# EAGLE design SparkFun_XMega100_Breakout (EAGLE 7.2.0)

## Sheet 1 of 2
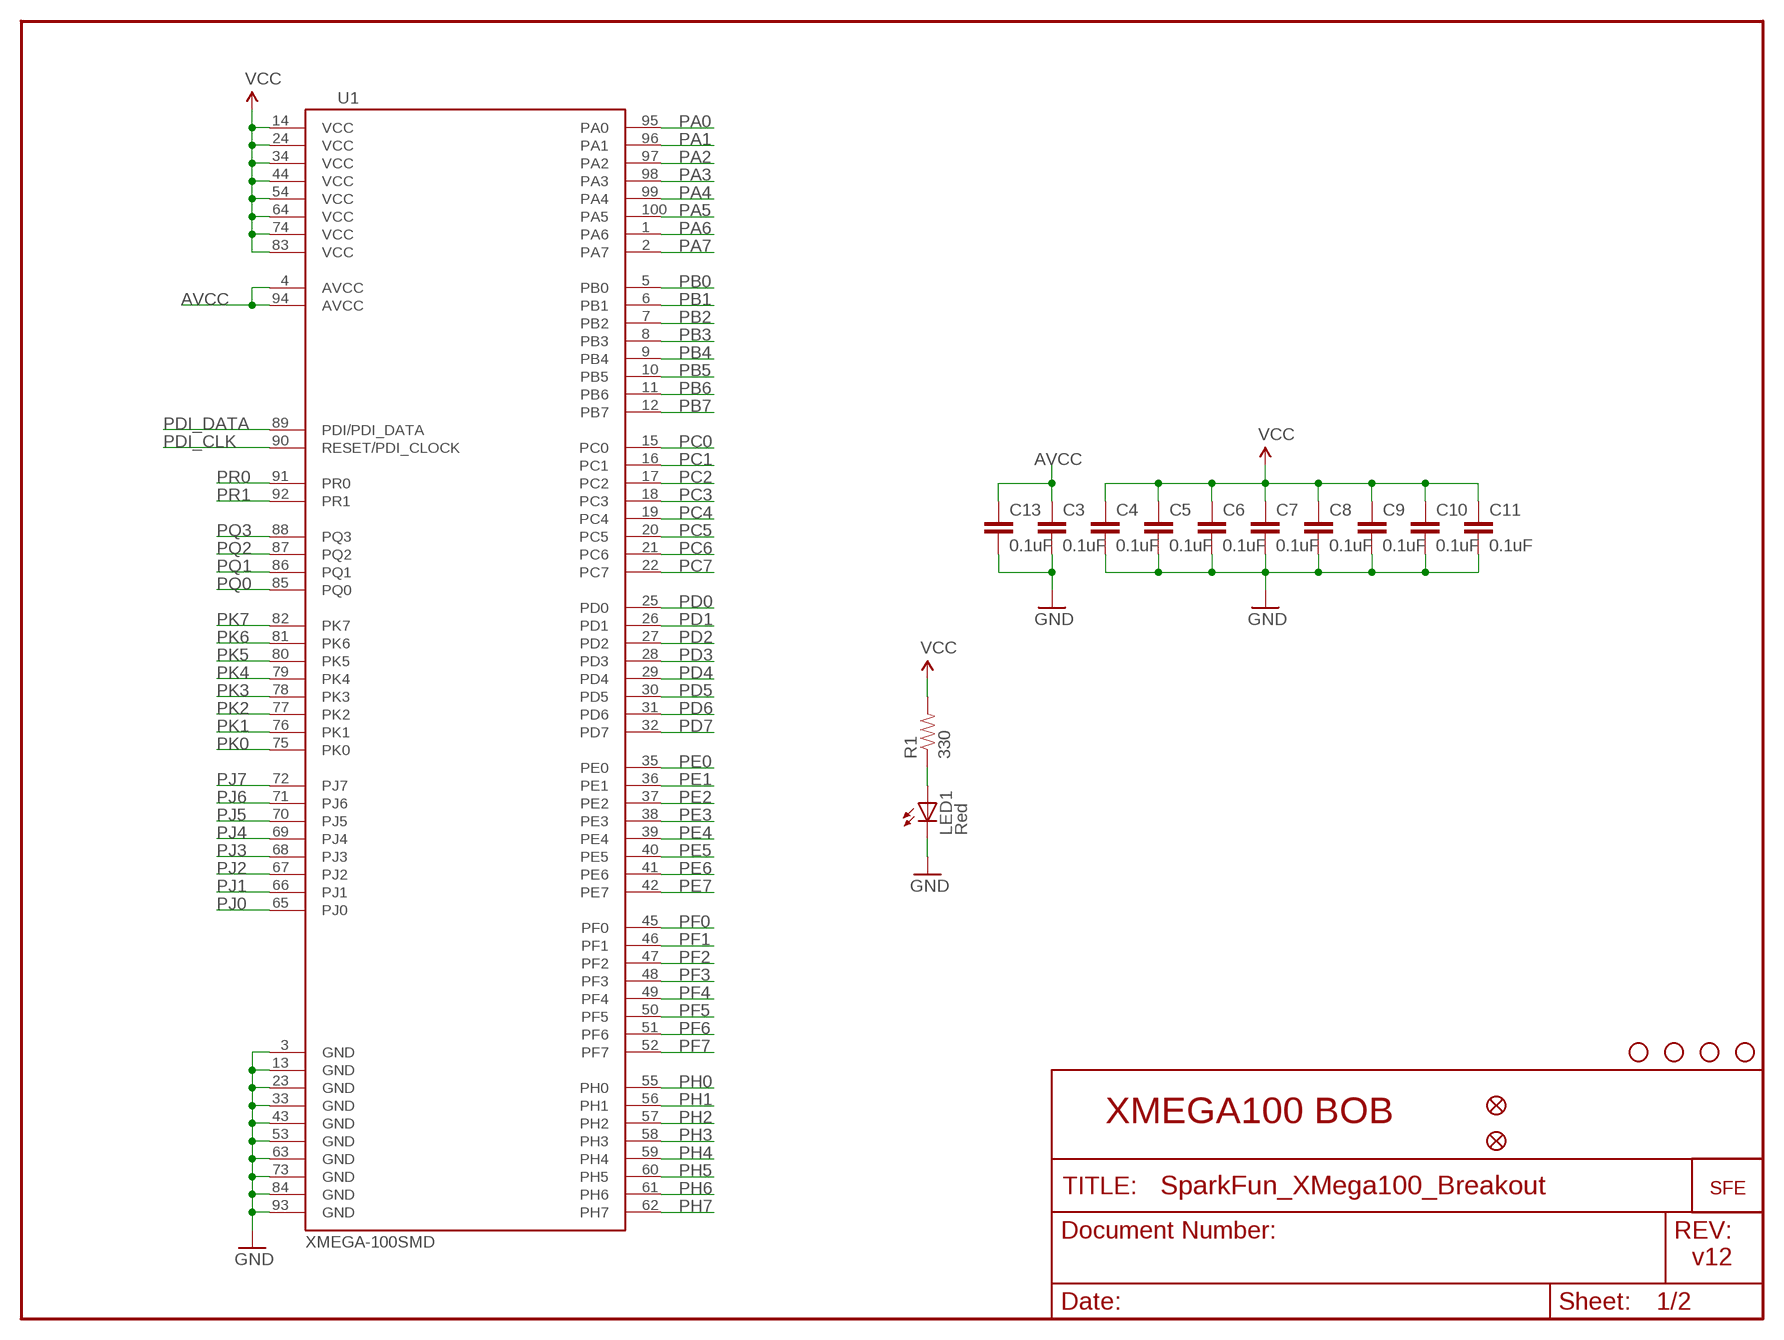
[diagram p0: schematic, sheet 1]

### Parts
C3  0.1uF  CAP0402-CAP  [0402-CAP]
C4  0.1uF  CAP0402-CAP  [0402-CAP]
C5  0.1uF  CAP0402-CAP  [0402-CAP]
C6  0.1uF  CAP0402-CAP  [0402-CAP]
C7  0.1uF  CAP0402-CAP  [0402-CAP]
C8  0.1uF  CAP0402-CAP  [0402-CAP]
C9  0.1uF  CAP0402-CAP  [0402-CAP]
C10  0.1uF  CAP0402-CAP  [0402-CAP]
C11  0.1uF  CAP0402-CAP  [0402-CAP]
C13  0.1uF  CAP0402-CAP  [0402-CAP]
JP1  LOGO-SFENEW  [SFE-NEW-WEBLOGO]
JP2  STAND-OFF  [STAND-OFF]
JP3  STAND-OFF  [STAND-OFF]
JP4  STAND-OFF  [STAND-OFF]
JP5  STAND-OFF  [STAND-OFF]
JP12  FIDUCIAL1X2  [FIDUCIAL-1X2]
JP13  FIDUCIAL1X2  [FIDUCIAL-1X2]
LED1  Red  LED0603  [LED-0603]
R1  330  RESISTOR0402-RES  [0402-RES]
U1  XMEGA-100SMD  [TQFP-100-14X14MM]

### Nets
AVCC: C3.1 C13.1 U1.4(AVCC) U1.94(AVCC) ; also sheet 2
GND: C3.2 C4.2 C5.2 C6.2 C7.2 C8.2 C9.2 C10.2 C11.2 C13.2 LED1.C U1.3(GND) U1.13(GND) U1.23(GND) U1.33(GND) U1.43(GND) U1.53(GND) U1.63(GND) U1.73(GND) U1.84(GND) U1.93(GND) ; also sheet 2
N$1: LED1.A R1.1
PA0: U1.95(PA0) ; also sheet 2
PA1: U1.96(PA1) ; also sheet 2
PA2: U1.97(PA2) ; also sheet 2
PA3: U1.98(PA3) ; also sheet 2
PA4: U1.99(PA4) ; also sheet 2
PA5: U1.100(PA5) ; also sheet 2
PA6: U1.1(PA6) ; also sheet 2
PA7: U1.2(PA7) ; also sheet 2
PB0: U1.5(PB0) ; also sheet 2
PB1: U1.6(PB1) ; also sheet 2
PB2: U1.7(PB2) ; also sheet 2
PB3: U1.8(PB3) ; also sheet 2
PB4: U1.9(PB4) ; also sheet 2
PB5: U1.10(PB5) ; also sheet 2
PB6: U1.11(PB6) ; also sheet 2
PB7: U1.12(PB7) ; also sheet 2
PC0: U1.15(PC0) ; also sheet 2
PC1: U1.16(PC1) ; also sheet 2
PC2: U1.17(PC2) ; also sheet 2
PC3: U1.18(PC3) ; also sheet 2
PC4: U1.19(PC4) ; also sheet 2
PC5: U1.20(PC5) ; also sheet 2
PC6: U1.21(PC6) ; also sheet 2
PC7: U1.22(PC7) ; also sheet 2
PD0: U1.25(PD0) ; also sheet 2
PD1: U1.26(PD1) ; also sheet 2
PD2: U1.27(PD2) ; also sheet 2
PD3: U1.28(PD3) ; also sheet 2
PD4: U1.29(PD4) ; also sheet 2
PD5: U1.30(PD5) ; also sheet 2
PD6: U1.31(PD6) ; also sheet 2
PD7: U1.32(PD7) ; also sheet 2
PDI_CLK: U1.90(RESET/PDI_CLOCK) ; also sheet 2
PDI_DATA: U1.89(PDI/PDI_DATA) ; also sheet 2
PE0: U1.35(PE0) ; also sheet 2
PE1: U1.36(PE1) ; also sheet 2
PE2: U1.37(PE2) ; also sheet 2
PE3: U1.38(PE3) ; also sheet 2
PE4: U1.39(PE4) ; also sheet 2
PE5: U1.40(PE5) ; also sheet 2
PE6: U1.41(PE6) ; also sheet 2
PE7: U1.42(PE7) ; also sheet 2
PF0: U1.45(PF0) ; also sheet 2
PF1: U1.46(PF1) ; also sheet 2
PF2: U1.47(PF2) ; also sheet 2
PF3: U1.48(PF3) ; also sheet 2
PF4: U1.49(PF4) ; also sheet 2
PF5: U1.50(PF5) ; also sheet 2
PF6: U1.51(PF6) ; also sheet 2
PF7: U1.52(PF7) ; also sheet 2
PH0: U1.55(PH0) ; also sheet 2
PH1: U1.56(PH1) ; also sheet 2
PH2: U1.57(PH2) ; also sheet 2
PH3: U1.58(PH3) ; also sheet 2
PH4: U1.59(PH4) ; also sheet 2
PH5: U1.60(PH5) ; also sheet 2
PH6: U1.61(PH6) ; also sheet 2
PH7: U1.62(PH7) ; also sheet 2
PJ0: U1.65(PJ0) ; also sheet 2
PJ1: U1.66(PJ1) ; also sheet 2
PJ2: U1.67(PJ2) ; also sheet 2
PJ3: U1.68(PJ3) ; also sheet 2
PJ4: U1.69(PJ4) ; also sheet 2
PJ5: U1.70(PJ5) ; also sheet 2
PJ6: U1.71(PJ6) ; also sheet 2
PJ7: U1.72(PJ7) ; also sheet 2
PK0: U1.75(PK0) ; also sheet 2
PK1: U1.76(PK1) ; also sheet 2
PK2: U1.77(PK2) ; also sheet 2
PK3: U1.78(PK3) ; also sheet 2
PK4: U1.79(PK4) ; also sheet 2
PK5: U1.80(PK5) ; also sheet 2
PK6: U1.81(PK6) ; also sheet 2
PK7: U1.82(PK7) ; also sheet 2
PQ0: U1.85(PQ0) ; also sheet 2
PQ1: U1.86(PQ1) ; also sheet 2
PQ2: U1.87(PQ2) ; also sheet 2
PQ3: U1.88(PQ3) ; also sheet 2
PR0: U1.91(PR0) ; also sheet 2
PR1: U1.92(PR1) ; also sheet 2
VCC: C4.1 C5.1 C6.1 C7.1 C8.1 C9.1 C10.1 C11.1 R1.2 U1.14(VCC) U1.24(VCC) U1.34(VCC) U1.44(VCC) U1.54(VCC) U1.64(VCC) U1.74(VCC) U1.83(VCC) ; also sheet 2

### Notes on the sheet
- XMEGA100 BOB
- v12

## Sheet 2 of 2
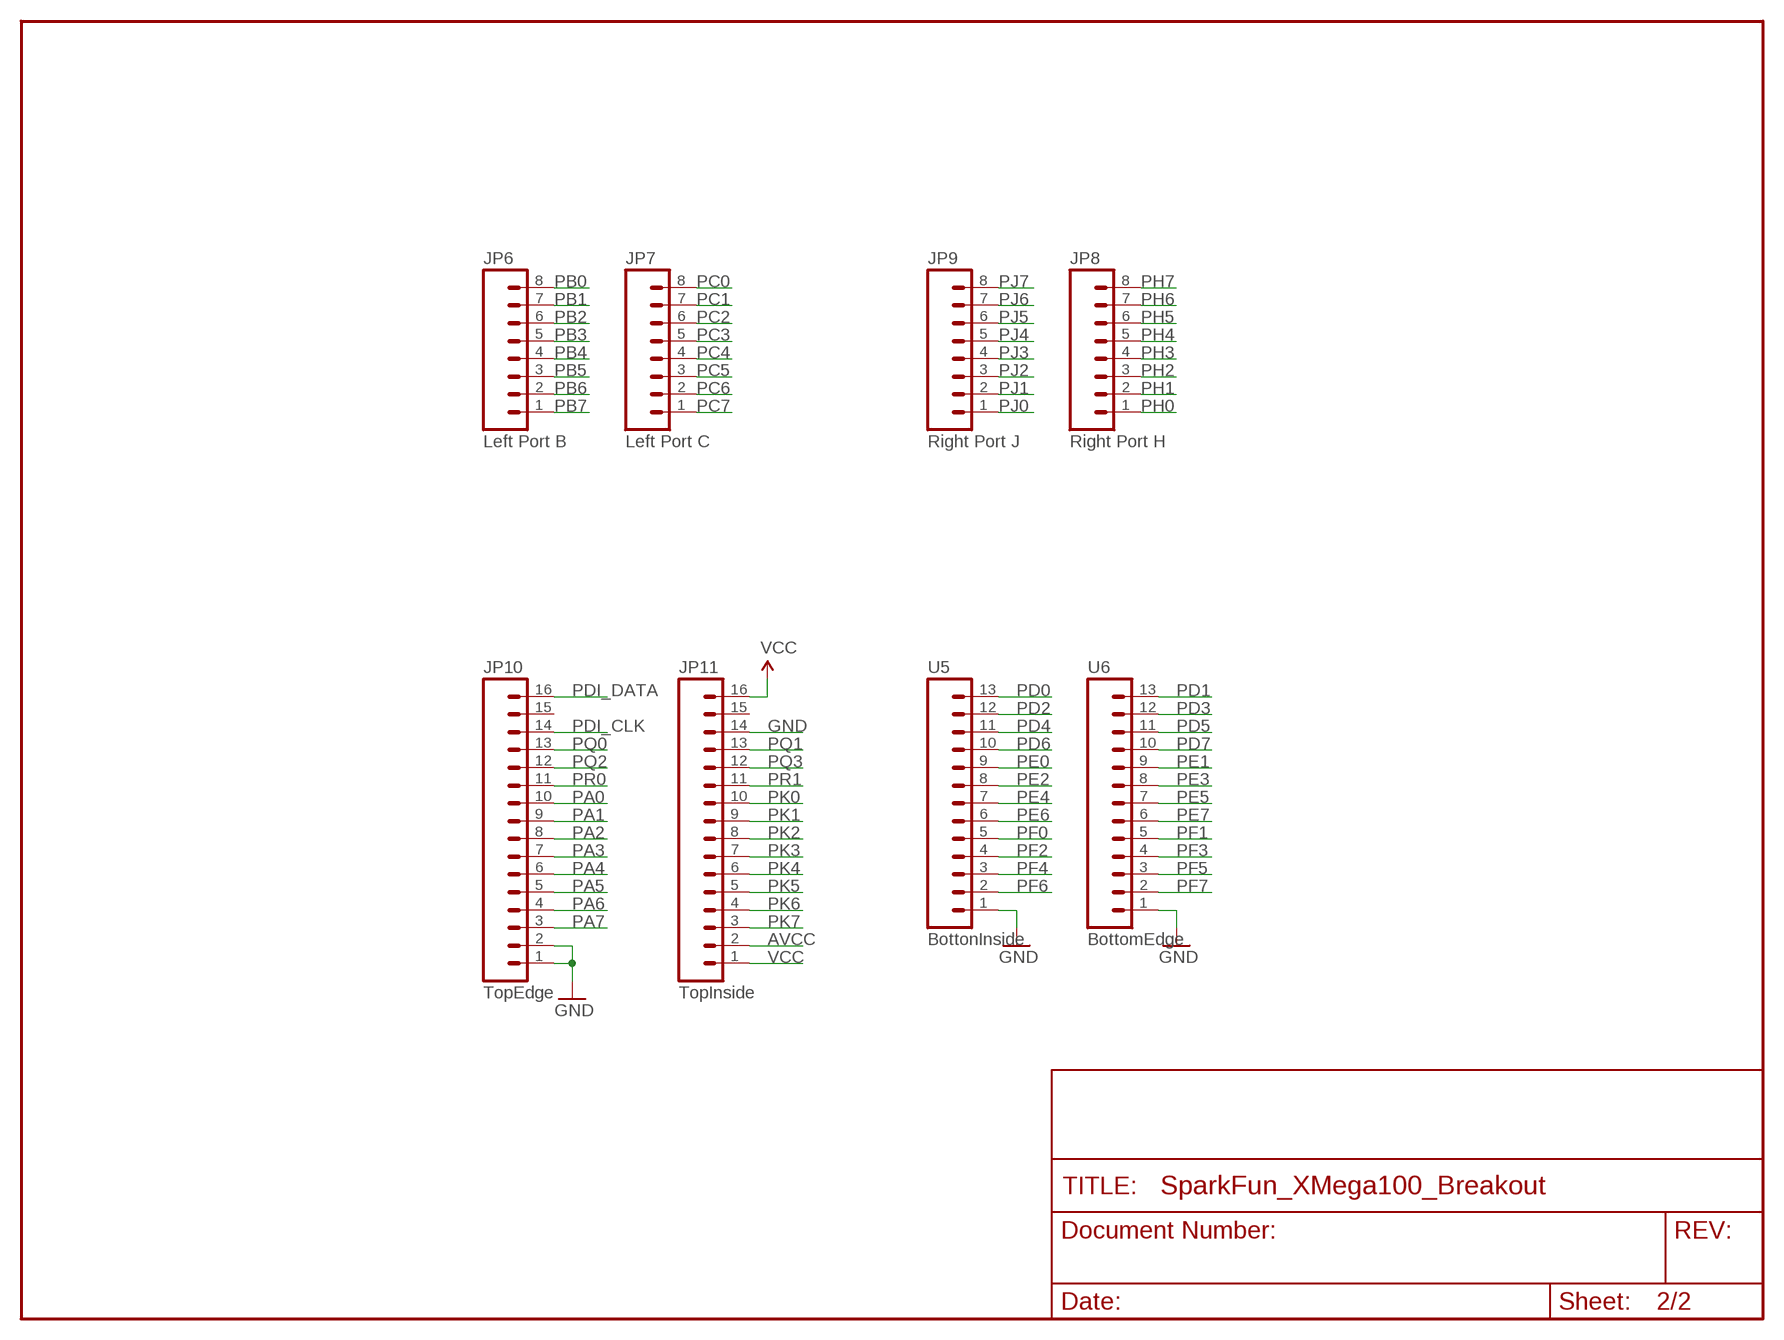
[diagram p1: schematic, sheet 2]

### Parts
JP6  Left Port B  M08  [1X08]
JP7  Left Port C  M08  [1X08]
JP8  Right Port H  M08  [1X08]
JP9  Right Port J  M08  [1X08]
JP10  TopEdge  M16PTH  [1X16]
JP11  TopInside  M16PTH  [1X16]
U5  BottonInside  M13  [1X13]
U6  BottomEdge  M13  [1X13]

### Nets
AVCC: JP11.2 ; also sheet 1
GND: JP10.1 JP10.2 JP11.14 U5.1 U6.1 ; also sheet 1
PA0: JP10.10 ; also sheet 1
PA1: JP10.9 ; also sheet 1
PA2: JP10.8 ; also sheet 1
PA3: JP10.7 ; also sheet 1
PA4: JP10.6 ; also sheet 1
PA5: JP10.5 ; also sheet 1
PA6: JP10.4 ; also sheet 1
PA7: JP10.3 ; also sheet 1
PB0: JP6.8 ; also sheet 1
PB1: JP6.7 ; also sheet 1
PB2: JP6.6 ; also sheet 1
PB3: JP6.5 ; also sheet 1
PB4: JP6.4 ; also sheet 1
PB5: JP6.3 ; also sheet 1
PB6: JP6.2 ; also sheet 1
PB7: JP6.1 ; also sheet 1
PC0: JP7.8 ; also sheet 1
PC1: JP7.7 ; also sheet 1
PC2: JP7.6 ; also sheet 1
PC3: JP7.5 ; also sheet 1
PC4: JP7.4 ; also sheet 1
PC5: JP7.3 ; also sheet 1
PC6: JP7.2 ; also sheet 1
PC7: JP7.1 ; also sheet 1
PD0: U5.13 ; also sheet 1
PD1: U6.13 ; also sheet 1
PD2: U5.12 ; also sheet 1
PD3: U6.12 ; also sheet 1
PD4: U5.11 ; also sheet 1
PD5: U6.11 ; also sheet 1
PD6: U5.10 ; also sheet 1
PD7: U6.10 ; also sheet 1
PDI_CLK: JP10.14 ; also sheet 1
PDI_DATA: JP10.16 ; also sheet 1
PE0: U5.9 ; also sheet 1
PE1: U6.9 ; also sheet 1
PE2: U5.8 ; also sheet 1
PE3: U6.8 ; also sheet 1
PE4: U5.7 ; also sheet 1
PE5: U6.7 ; also sheet 1
PE6: U5.6 ; also sheet 1
PE7: U6.6 ; also sheet 1
PF0: U5.5 ; also sheet 1
PF1: U6.5 ; also sheet 1
PF2: U5.4 ; also sheet 1
PF3: U6.4 ; also sheet 1
PF4: U5.3 ; also sheet 1
PF5: U6.3 ; also sheet 1
PF6: U5.2 ; also sheet 1
PF7: U6.2 ; also sheet 1
PH0: JP8.1 ; also sheet 1
PH1: JP8.2 ; also sheet 1
PH2: JP8.3 ; also sheet 1
PH3: JP8.4 ; also sheet 1
PH4: JP8.5 ; also sheet 1
PH5: JP8.6 ; also sheet 1
PH6: JP8.7 ; also sheet 1
PH7: JP8.8 ; also sheet 1
PJ0: JP9.1 ; also sheet 1
PJ1: JP9.2 ; also sheet 1
PJ2: JP9.3 ; also sheet 1
PJ3: JP9.4 ; also sheet 1
PJ4: JP9.5 ; also sheet 1
PJ5: JP9.6 ; also sheet 1
PJ6: JP9.7 ; also sheet 1
PJ7: JP9.8 ; also sheet 1
PK0: JP11.10 ; also sheet 1
PK1: JP11.9 ; also sheet 1
PK2: JP11.8 ; also sheet 1
PK3: JP11.7 ; also sheet 1
PK4: JP11.6 ; also sheet 1
PK5: JP11.5 ; also sheet 1
PK6: JP11.4 ; also sheet 1
PK7: JP11.3 ; also sheet 1
PQ0: JP10.13 ; also sheet 1
PQ1: JP11.13 ; also sheet 1
PQ2: JP10.12 ; also sheet 1
PQ3: JP11.12 ; also sheet 1
PR0: JP10.11 ; also sheet 1
PR1: JP11.11 ; also sheet 1
VCC: JP11.1 JP11.16 ; also sheet 1
Unconnected: JP10.15 JP11.15

## Library data of the parts
C3-C11 C13 = SparkFun:CAP: Capacitor Standard 0603 ceramic capacitor, and 0.1" leaded capacitor.
JP1 = SparkFun:LOGO-SFE: Spark Fun Electronics PCB Logo This is the standard Spark Fun Electronics PCB logo.
JP2-JP5 = SparkFun:STAND-OFF: Stand Off This is the mechanical footprint for a #4 phillips button head screw. Use the keepout ring to avoid running the screw head into surrounding components. SKU : PRT-00447
JP6-JP9 = SparkFun:M08: Header 8 Standard 8-pin 0.1" header. Use with straight break away headers (SKU : PRT-00116), right angle break away headers (PRT-00553), swiss pins (PRT-00743), machine pins (PRT-00117), and female headers (PRT-00115).
JP10 JP11 = SparkFun:M16
JP12 JP13 = SparkFun:FIDUCIAL: Fiducial Alignment Points Various fiducial points for machine vision alignment.
LED1 = SparkFun:LED: LEDs Standard schematic elements and footprints for 5mm, 3mm, 1206, and 0603 sized LEDs. 5mm - Spark Fun Electronics SKU : COM-00529 (and others)
R1 = SparkFun:RESISTOR: Resistor Basic schematic elements and footprints for 0603, 1206, and PTH 1/10th watt (small) resistors.
U1 = SparkFun:XMEGA-100
U5 U6 = SparkFun:M13

## Board
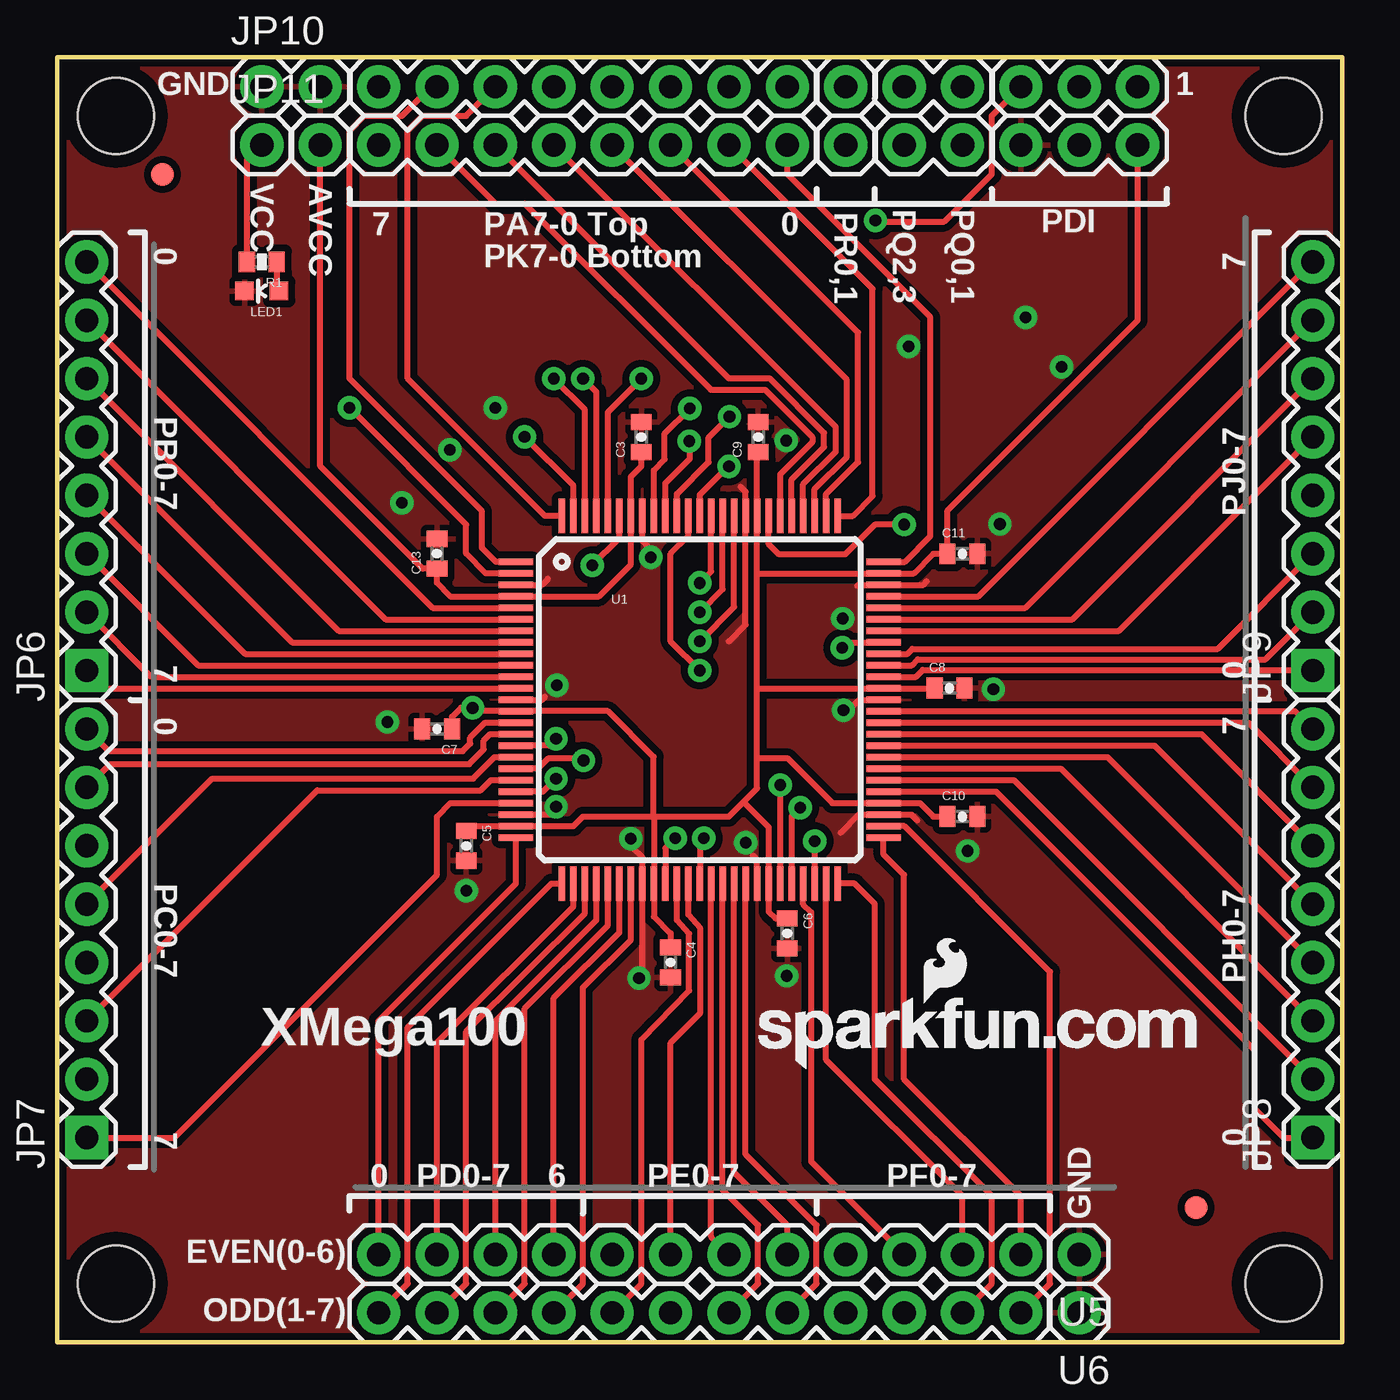
[diagram p2: board, top side]
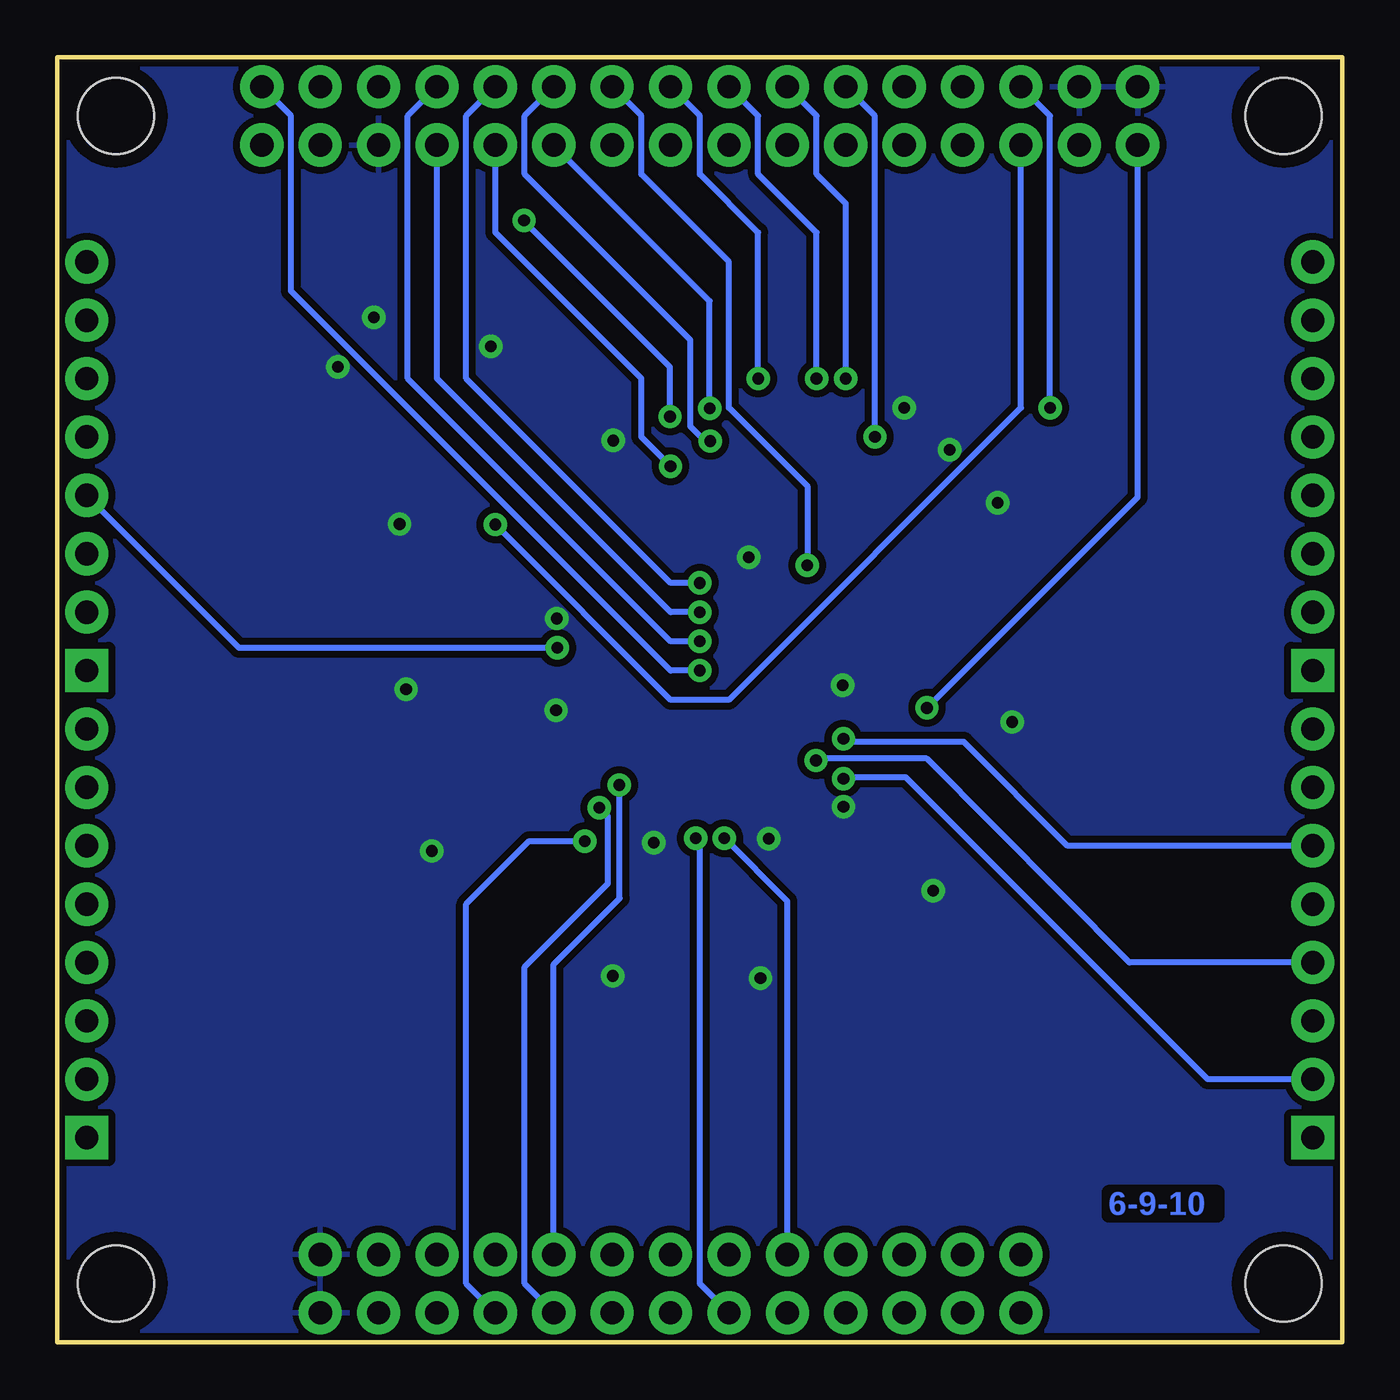
[diagram p3: board, bottom side, seen from below]

Size 55.88 x 55.88 mm. Coordinates in mm from the lower left corner, seen from the top.
Outline: 0,0 55.88,0 55.88,55.88 0,55.88 0,0
Copper layers (1*16): Top 0.035mm / dielectric 1.5mm / Bottom 0.035mm
Design rules "SparkFun": minimum track width 8mil, minimum drill 20mil, track to track 8mil, track to pad 8mil, pad to pad 8mil, via to via 8mil, smd to smd 8mil, copper to edge 8mil, drill to drill 8mil, minimum pad ring 12mil, minimum via ring 10mil, stop-mask expansion 4mil, vias tented up to drill 20mil, thermal gap 10mil

### Footprints (pad centres in the part's own frame; a part is rotated, then mirrored left to right if it is on the bottom)
0402-CAP = smd 0.7 x 0.9: 1 -0.65,0; 2 0.65,0
STAND-OFF = hole 3.302: 0,0
1X08 = drill 1.016 pad 1.88 square: 1 0,0 | drill 1.016 pad 1.88: 2 2.54,0; 3 5.08,0; 4 7.62,0; 5 10.16,0; 6 12.7,0; 7 15.24,0; 8 17.78,0
1X16 = drill 1.016 pad 1.88: 1 0,0; 2 2.54,0; 3 5.08,0; 4 7.62,0; 5 10.16,0; 6 12.7,0; 7 15.24,0; 8 17.78,0; 9 20.32,0; 10 22.86,0; 11 25.4,0; 12 27.94,0; 13 30.48,0; 14 33.02,0; 15 35.56,0; 16 38.1,0
FIDUCIAL-1X2 = smd 1 x 1: 1 0,0
LED-0603 = smd 0.8 x 0.8: A 0,-0.75; C 0,0.75
0402-RES = smd 0.7 x 0.9: 1 -0.65,0; 2 0.65,0
TQFP-100-14X14MM = smd 1.5 x 0.27: 1 -8,6; 2 -8,5.5; 3 -8,5; 4 -8,4.5; 5 -8,4; 6 -8,3.5; 7 -8,3; 8 -8,2.5; 9 -8,2; 10 -8,1.5; 11 -8,1; 12 -8,0.5; 13 -8,0; 14 -8,-0.5; 15 -8,-1; 16 -8,-1.5; 17 -8,-2; 18 -8,-2.5; 19 -8,-3; 20 -8,-3.5; 21 -8,-4; 22 -8,-4.5; 23 -8,-5; 24 -8,-5.5; 25 -8,-6; 51 8,-6; 52 8,-5.5; 53 8,-5; 54 8,-4.5; 55 8,-4; 56 8,-3.5; 57 8,-3; 58 8,-2.5; 59 8,-2; 60 8,-1.5; 61 8,-1; 62 8,-0.5; 63 8,0; 64 8,0.5; 65 8,1; 66 8,1.5; 67 8,2; 68 8,2.5; 69 8,3; 70 8,3.5; 71 8,4; 72 8,4.5; 73 8,5; 74 8,5.5; 75 8,6 | smd 0.27 x 1.5: 26 -6,-8; 27 -5.5,-8; 28 -5,-8; 29 -4.5,-8; 30 -4,-8; 31 -3.5,-8; 32 -3,-8; 33 -2.5,-8; 34 -2,-8; 35 -1.5,-8; 36 -1,-8; 37 -0.5,-8; 38 0,-8; 39 0.5,-8; 40 1,-8; 41 1.5,-8; 42 2,-8; 43 2.5,-8; 44 3,-8; 45 3.5,-8; 46 4,-8; 47 4.5,-8; 48 5,-8; 49 5.5,-8; 50 6,-8; 76 6,8; 77 5.5,8; 78 5,8; 79 4.5,8; 80 4,8; 81 3.5,8; 82 3,8; 83 2.5,8; 84 2,8; 85 1.5,8; 86 1,8; 87 0.5,8; 88 0,8; 89 -0.5,8; 90 -1,8; 91 -1.5,8; 92 -2,8; 93 -2.5,8; 94 -3,8; 95 -3.5,8; 96 -4,8; 97 -4.5,8; 98 -5,8; 99 -5.5,8; 100 -6,8
1X13 = drill 1.016 pad 1.88: 1 0,0; 2 2.54,0; 3 5.08,0; 4 7.62,0; 5 10.16,0; 6 12.7,0; 7 15.24,0; 8 17.78,0; 9 20.32,0; 10 22.86,0; 11 25.4,0; 12 27.94,0; 13 30.48,0

### Placement (x,y rotation side)
C3  25.4,39.37 90 top
C4  26.67,16.51 270 top
C5  17.78,21.59 270 top
C6  31.75,17.78 270 top
C7  16.51,26.67 180 top
C8  38.81,28.45 0 top
C9  30.48,39.37 90 top
C10  39.37,22.86 0 top
C11  39.37,34.29 0 top
C13  16.51,34.29 90 top
JP1  30.48,11.86 0 top
JP2  2.54,53.34 0 top
JP3  2.54,2.54 0 top
JP4  53.34,53.34 0 top
JP5  53.34,2.54 0 top
JP6  1.27,29.21 90 top
JP7  1.27,8.89 90 top
JP8  54.61,8.89 90 top
JP9  54.61,29.21 90 top
JP10  8.89,54.61 0 top
JP11  8.89,52.07 0 top
JP12  4.57,50.8 0 top
JP13  49.53,5.84 0 top
LED1  8.89,45.72 90 top
R1  8.89,46.99 180 top
U1  27.94,27.94 0 top
U5  44.45,3.81 180 top
U6  44.45,1.27 180 top

### Tracks (layer width: path | path; a pad name or v marks a point on that pad's centre or on a via)
AVCC
  Top 0.254: C3.1 25.4,38.1 24.94,37.64 U1.94 24.94,33.83 23.55,32.44 U1.4 17.09,32.44 16.51,33.02 C13.1 15.89,33.64 11.43,38.1 JP11.2
GND  (via drill 0.51)
  Top 0.254: U1.13 21.08,27.94 21.21,28.07 | 29.72,37.21 29.94,36.99 U1.84 29.94,31.21 29.21,30.48 | U1.23 21.42,22.94 v21.69,23.29 | 25.07,21.46 25.44,21.09 U1.33 25.44,15.97 v25.3,15.82 | U1.43 30.44,20.97 30.25,21.16 | 34.06,22.15 34.85,22.94 U1.53 37.16,22.94 37.39,22.71 | U1.63 34.87,27.94 34.62,27.69 | 34.8,32.89 34.84,32.94 U1.73 37.66,32.94 37.82,33.1 | U1.3 21.08,32.94 21.34,33.2 | U1.93 25.44,34.86 25.65,34.65
  other vias: 14.35,26.97 21.72,28.57 14.99,36.5 17.78,19.63 24.94,21.89 29.95,21.72 31.72,15.93 39.6,21.36 40.72,28.4 34.19,27.48 34.16,31.47 41,35.59 31.7,39.22 17.07,38.81 37.03,43.31 42.11,44.58 25.81,34.14 43.69,42.42 19.05,40.64
  pour Top (isolate 0.305): 0,55.88 0,0 55.88,0 55.88,55.88
  pour Bottom (isolate 0.305): 0,0 0,55.88 55.88,55.88 55.88,0
N$1
  Top 0.254: R1.1 9.54,45.82 LED1.A
PA0  (via drill 0.51)
  Top 0.254: U1.95 24.44,34.98 23.24,33.78 v23.27,33.78
  Bottom 0.254: JP10.10 30.48,53.34 30.48,50.8 26.67,46.99 26.67,40.64 23.24,37.21 23.24,33.81 v23.27,33.78
PA1  (via drill 0.51)
  Top 0.254: U1.96 23.94,40.45 v25.4,41.91
  Bottom 0.254: v25.4,41.91 25.4,48.26 27.94,50.8 27.94,53.34 JP10.9
PA2  (via drill 0.51)
  Top 0.254: U1.97 23.44,41.33 v22.86,41.91
  Bottom 0.254: JP10.8 25.4,53.34 25.4,50.8 22.86,48.26 v22.86,41.91
PA3  (via drill 0.51)
  Top 0.254: U1.98 22.94,40.56 v21.59,41.91
  Bottom 0.254: JP10.7 22.86,53.34 22.86,50.8 21.59,49.53 v21.59,41.91
PA4  (via drill 0.51)
  Top 0.254: U1.99 22.44,37.25 v20.32,39.37
  Bottom 0.254: v20.32,39.37 20.32,53.34 JP10.6
PA5
  Top 0.254: U1.100 21.21,35.94 15.24,41.91 15.24,52.7 15.88,53.34 17.78,53.34 JP10.5
PA6
  Top 0.254: U1.1 19.07,33.94 18.47,34.54 18.47,36.14 12.7,41.91 12.7,52.7 13.34,53.34 14.99,53.34 16,54.36 16.26,54.36 JP10.4
PA7  (via drill 0.51)
  Top 0.254: U1.2 18.63,33.44 17.78,34.29 17.78,35.56 v12.7,40.64
  Bottom 0.254: v12.7,40.64 12.7,53.34 JP10.3
PB0
  Top 0.254: U1.5 16.32,31.94 JP6.8
PB1
  Top 0.254: U1.6 14.28,31.44 JP6.7
PB2
  Top 0.254: U1.7 12.24,30.94 JP6.6
PB3
  Top 0.254: U1.8 10.2,30.44 JP6.5
PB4
  Top 0.254: U1.9 8.16,29.94 JP6.4
PB5
  Top 0.254: U1.10 6.12,29.44 JP6.3
PB6
  Top 0.254: U1.11 4.08,28.94 JP6.2
PB7
  Top 0.254: U1.12 2.04,28.44 JP6.1
PC0
  Top 0.254: JP7.8 1.83,26.11 2.16,25.78 2.23,25.7 17.63,25.7 17.96,26.04 17.96,26.29 18.61,26.94 U1.15
PC1
  Top 0.254: U1.16 18.82,26.44 18.54,26.16 18.54,25.78 17.91,25.15 2.29,25.15 JP7.7
PC2  (via drill 0.51)
  Top 0.254: U1.17 21.39,25.94 v21.69,26.24
  Bottom 0.254: JP7.6 11.94,21.59 16.46,26.11 21.64,26.11 v21.69,26.24
PC3
  Top 0.254: JP7.5 6.73,24.51 18.09,24.51 19.01,25.44 U1.18
PC4  (via drill 0.51)
  Top 0.254: U1.19 20.9,24.94 21.34,25.38 22.81,25.38 v22.89,25.3
  Bottom 0.254: JP7.4 9.25,16.51 18.06,25.38 22.86,25.38 v22.89,25.3
PC5
  Top 0.254: U1.20 18.85,24.44 18.41,24 11.3,24 JP7.3
PC6  (via drill 0.51)
  Top 0.254: U1.21 21.12,23.94 v21.69,24.51
  Bottom 0.254: JP7.2 5.84,11.43 18.97,24.56 21.64,24.56 v21.69,24.51
PC7
  Top 0.254: U1.22 17.09,23.44 16.51,22.86 16.51,20.32 5.08,8.89 JP7.1
PD0
  Top 0.254: U1.25 19.94,19.94 13.97,13.97 U5.13
PD1
  Top 0.254: U1.26 21.49,19.94 15.24,13.69 15.24,2.54 U6.13
PD2
  Top 0.254: U1.27 22.44,18.96 16.51,13.03 U5.12
PD3
  Top 0.254: U1.28 22.94,18.65 17.78,13.51 17.78,2.54 U6.12
PD4
  Top 0.254: U1.29 23.44,18.36 19.05,13.97 U5.11
PD5
  Top 0.254: U1.30 23.94,18.12 20.32,14.5 20.32,2.54 U6.11
PD6
  Top 0.254: U1.31 24.44,17.81 21.59,14.96 U5.10
PD7
  Top 0.254: U1.32 24.94,17.5 22.86,15.42 22.86,2.54 U6.10
PDI_CLK  (via drill 0.51)
  Top 0.254: U1.90 26.94,36.9 28.32,38.28 28.32,39.34 v29.23,40.26 29.23,40.23 | JP10.14 40.64,53.34 40.64,50.8 38.58,48.74 35.64,48.74 v35.59,48.79
  Bottom 0.254: v29.23,40.26 29.23,42.42 35.59,48.77 v35.59,48.79
PDI_DATA  (via drill 0.51)
  Top 0.254: U1.89 27.44,35.06 26.67,34.29 26.67,30.48 v27.94,29.21
  Bottom 0.254: JP10.16 45.72,53.34 45.72,45.72 29.21,29.21 v27.94,29.21
PE0  (via drill 0.51)
  Top 0.254: U1.35 26.44,21.49 v26.87,21.92
  Bottom 0.254: U5.9 24.13,19.18 v26.87,21.92
PE1
  Top 0.254: U1.36 26.94,18.35 27.48,17.75 27.48,15.29 25.4,13.16 25.4,2.54 U6.9
PE2
  Top 0.254: U1.37 27.44,18.59 27.96,17.98 27.96,14.33 26.67,13.01 U5.8
PE3  (via drill 0.51)
  Top 0.254: U1.38 27.94,21.74 v28.12,21.92
  Bottom 0.254: U6.8 27.94,2.54 27.94,21.74 v28.12,21.92
PE4
  Top 0.254: U1.39 28.44,4.58 U5.7
PE5
  Top 0.254: U6.7 30.48,2.54 30.48,5.08 28.94,6.62 U1.40
PE6
  Top 0.254: U5.6 31.75,5.08 29.44,7.39 U1.41
PE7
  Top 0.254: U6.6 33.02,2.54 33.02,5.08 29.94,8.16 U1.42
PF0  (via drill 0.51)
  Top 0.254: U1.45 v31.44,24.23 v31.45,24.23
  Bottom 0.254: U5.5 34.29,16.43 31.42,19.3 31.42,24.21 v31.45,24.23
PF1  (via drill 0.51)
  Top 0.254: U1.46 31.94,22.87 v32.31,23.24
  Bottom 0.254: U6.5 35.56,2.54 35.56,16.32 U1.46 31.94,22.87 v32.31,23.24
PF2
  Top 0.254: U1.47 32.44,19.05 32.79,18.69 32.79,7.85 U5.4
PF3  (via drill 0.51)
  Top 0.254: U1.48 v32.94,21.79
  Bottom 0.254: U6.4 38.1,2.54 38.1,19.05 35.36,21.79 v32.94,21.79
PF4
  Top 0.254: U1.49 33.44,12.28 39.37,6.35 U5.3
PF5
  Top 0.254: U1.50 34.67,19.94 35.56,19.05 35.56,11.43 40.64,6.35 40.64,2.54 U6.3
PF6
  Top 0.254: U5.2 41.91,6.35 36.83,11.43 36.83,20.32 35.94,21.21 U1.51
PF7
  Top 0.254: U6.2 43.18,2.54 43.18,16.1 36.84,22.44 U1.52
PH0
  Top 0.254: U1.55 40.83,23.94 52.07,12.7 52.07,10.16 53.34,8.89 JP8.1
PH1
  Top 0.254: U1.56 41.6,24.44 JP8.2
PH2
  Top 0.254: U1.57 43.64,24.94 JP8.3
PH3
  Top 0.254: U1.58 45.68,25.44 JP8.4
PH4
  Top 0.254: 54.59,19.02 JP8.5 47.72,25.94 U1.59
PH5
  Top 0.254: 54.59,21.61 JP8.6 49.76,26.44 U1.60
PH6
  Top 0.254: U1.61 51.8,26.94 JP8.7
PH7
  Top 0.254: U1.62 53.84,27.44 JP8.8
PJ0
  Top 0.254: U1.65 37.35,28.94 37.64,29.23 54.59,29.23 JP9.1
PJ1
  Top 0.254: U1.66 37.16,29.44 37.41,29.69 52.55,29.69 JP9.2
PJ2
  Top 0.254: U1.67 36.98,29.94 37.19,30.15 50.47,30.15 JP9.3
PJ3  (via drill 0.51)
  Top 0.254: U1.68 34.38,30.44 v34.14,30.2
  Bottom 0.254: v34.14,30.2 47.98,30.2 JP9.4
PJ4
  Top 0.254: U1.69 46.18,30.94 JP9.5
PJ5
  Top 0.254: U1.70 44.14,31.44 JP9.6
PJ6
  Top 0.254: U1.71 42.1,31.94 JP9.7
PJ7
  Top 0.254: U1.72 40.06,32.44 JP9.8
PK0
  Top 0.254: JP11.10 31.75,50.8 37.97,44.58 37.97,35.05 36.86,33.94 U1.75
PK1
  Top 0.254: U1.76 34.59,35.94 35.46,36.8 35.46,45.82 JP11.9
PK2
  Top 0.254: JP11.8 34.82,43.92 34.82,38.28 33.44,36.89 U1.77
PK3
  Top 0.254: U1.78 32.94,37.11 34.34,38.51 34.34,41.86 JP11.7
PK4
  Top 0.254: U1.79 32.44,37.32 33.86,38.73 33.86,39.8 JP11.6
PK5
  Top 0.254: U1.80 31.94,37.53 33.35,38.94 33.35,39.55 30.99,41.91 29.21,41.91 JP11.5
PK6
  Top 0.254: U1.81 31.44,37.74 32.84,39.14 32.84,39.37 30.79,41.43 28.42,41.43 20.32,49.53 19.05,49.53 JP11.4
PK7  (via drill 0.51)
  Top 0.254: U1.82 30.94,34.72 31.39,34.27 34.27,34.27 35.56,35.56 v36.83,35.56
  Bottom 0.254: JP11.3 13.97,40.64 26.67,27.94 29.21,27.94 v36.83,35.56
PQ0  (via drill 0.51)
  Top 0.254: U1.85 29.44,31.98 v27.94,30.48
  Bottom 0.254: JP10.13 40.64,53.34 40.64,41.91 29.21,30.48 v27.94,30.48
PQ1  (via drill 0.51)
  Top 0.254: U1.86 28.94,32.75 v27.94,31.75
  Bottom 0.254: JP11.13 39.37,41.91 29.21,31.75 v27.94,31.75
PQ2  (via drill 0.51)
  Top 0.254: U1.87 28.44,33.52 v27.94,33.02
  Bottom 0.254: JP10.12 38.1,53.34 38.1,41.91 29.21,33.02 v27.94,33.02
PQ3  (via drill 0.51)
  Top 0.254: U1.88 27.94,36.85 29.18,38.1 v29.21,38.1
  Bottom 0.254: v29.21,38.1 30.48,39.37 30.48,41.91 36.83,48.26 JP11.12
PR0  (via drill 0.51)
  Top 0.254: v27.48,39.19 27.51,39.17 27.51,38.43 26.44,37.36 U1.91
  Bottom 0.254: JP10.11 35.56,53.34 35.56,50.8 28.35,43.59 28.35,39.83 27.71,39.19 v27.48,39.19
PR1  (via drill 0.51)
  Top 0.254: U1.92 25.94,37.93 26.42,38.41 26.42,39.52 v27.51,40.62
  Bottom 0.254: v27.51,40.62 27.51,45.29 JP11.11
VCC  (via drill 0.51)
  Top 0.254: C9.1 30.44,38.68 U1.83 30.44,33.4 | C10.1 38.1,22.86 37.52,23.44 U1.54 33.71,23.44 31.75,25.4 30.44,25.4 | 30.44,25.4 30.44,24.09 29.84,23.5 | 30.44,25.4 30.44,28.45 | 30.44,28.45 30.44,33.4 | 29.84,23.5 29.21,22.86 25.91,22.86 | 25.91,22.86 25.94,22.83 U1.34 25.94,18.51 26.67,17.78 C4.1 | 29.84,23.5 30.94,22.4 U1.44 30.94,18.72 31.23,18.43 C6.1 | 30.44,33.4 30.48,33.44 U1.74 37.25,33.44 38.1,34.29 C11.1 38.72,36.18 46.99,44.45 JP11.16 | 30.44,28.45 30.45,28.44 U1.64 C8.1 | C5.1 17.98,22.44 U1.24 22.44,22.44 22.86,22.86 25.91,22.86 | R1.2 8.24,51.42 JP11.1 | C7.1 17.16,27.19 17.55,27.58 v18.06,27.58 18.2,27.44 U1.14 23.94,27.44 25.93,25.45 25.93,22.89 25.91,22.86
  Bottom 0.254: JP11.1 8.89,36.75 v18.06,27.58

### Text on the board
Bottom: 6-9-10
tPlace: GND | 1 | VCC | AVCC | 7 | 0 | PR0,1 | PQ2,3 | PQ0,1 | 0 | PA7-0 Top | PDI | PK7-0 Bottom | 7 | PB0-7 | PJ0-7 | 7 | 0 | 0 | 7 | PC0-7 | PH0-7 | XMega100 | 7 | 0 | 0 | PD0-7 | 6 | PE0-7 | PF0-7 | GND | EVEN(0-6) | ODD(1-7)